# EAGLE design Blocky_Node _v1.1 (EAGLE 9.2.2)

## Sheet 1 of 2
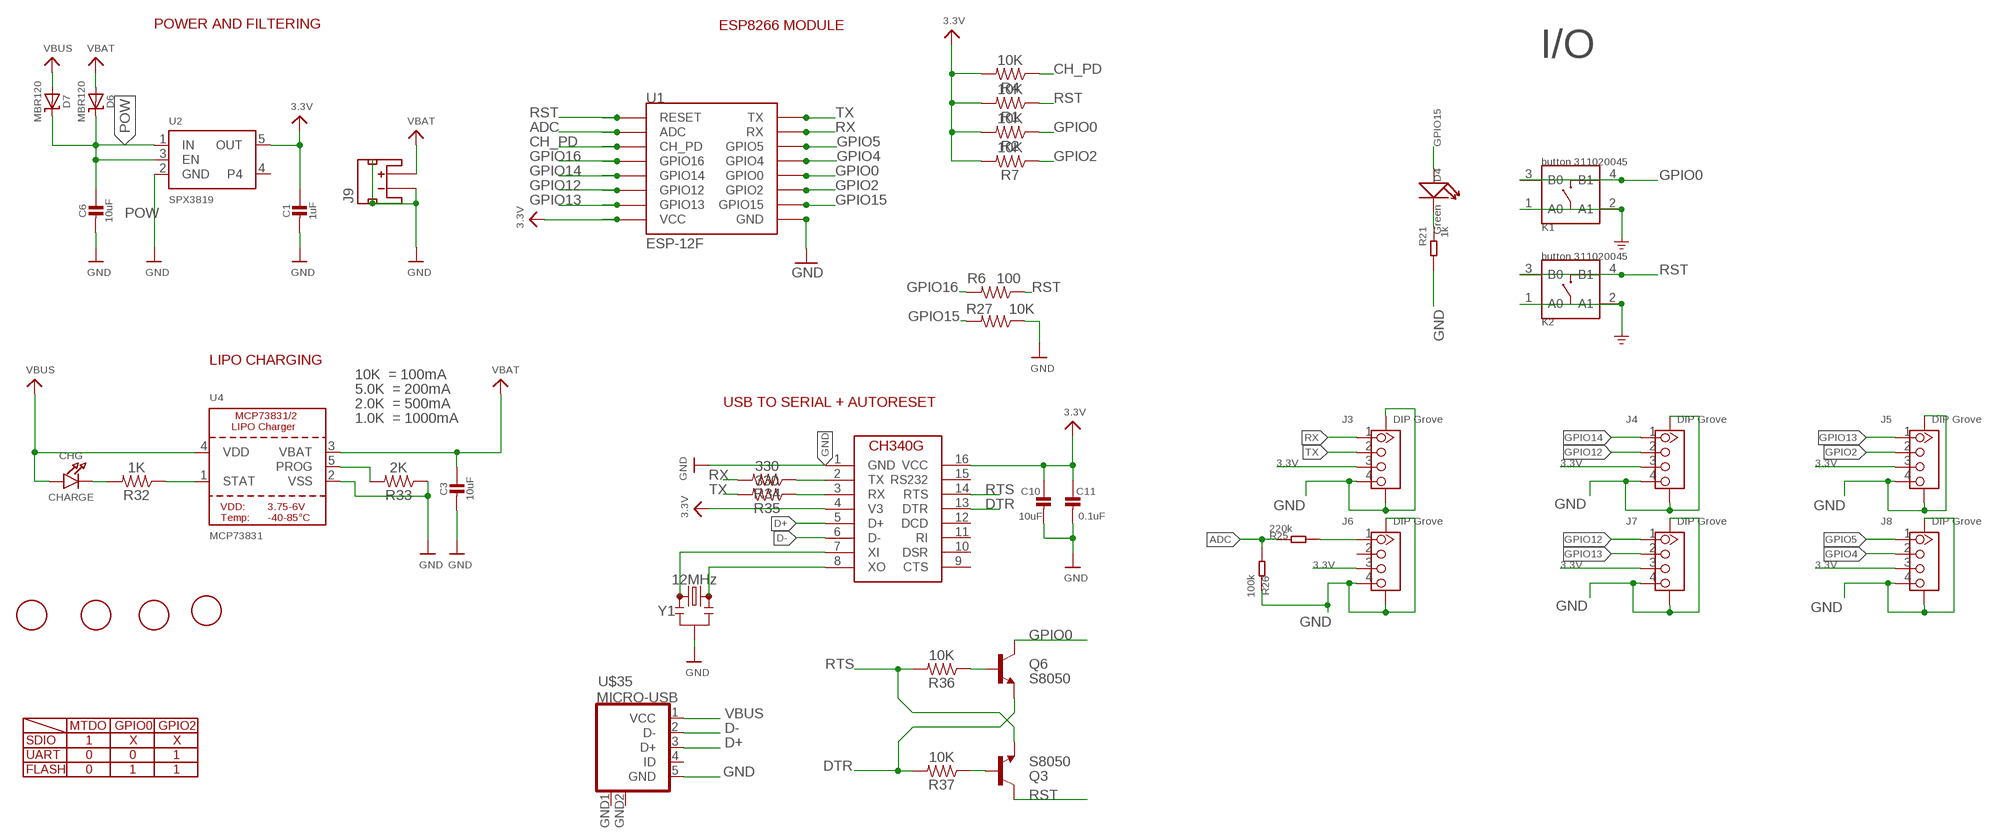
[diagram p0: schematic, sheet 1]

### Parts
C1  1uF  CAP_CERAMIC_0603  [_0603]
C3  10uF  CAP_CERAMIC_0603  [_0603]
C6  10uF  CAP_CERAMIC_0603  [_0603]
C10  10uF  CAP_CERAMIC_0603  [_0603]
C11  0.1uF  CAP_CERAMIC_0603  [_0603]
CHG  CHARGE  LED0603  [CHIPLED_0603]
D4  Green  LED'0603'  [LED-0603]
D6  MBR120  DIODE-SCHOTTKYSOD-123  [SOD-123]
D7  MBR120  DIODE-SCHOTTKYSOD-123  [SOD-123]
J3  DIP Grove  GROVE-CONNECTOR-SMD'90D'  [HW4-SMD-2.0-90D]
J4  DIP Grove  GROVE-CONNECTOR-SMD'90D'  [HW4-SMD-2.0-90D]
J5  DIP Grove  GROVE-CONNECTOR-SMD'90D'  [HW4-SMD-2.0-90D]
J6  DIP Grove  GROVE-CONNECTOR-SMD'90D'  [HW4-SMD-2.0-90D]
J7  DIP Grove  GROVE-CONNECTOR-SMD'90D'  [HW4-SMD-2.0-90D]
J8  DIP Grove  GROVE-CONNECTOR-SMD'90D'  [HW4-SMD-2.0-90D]
J9  JST_2MM_MALE  [JST-2-SMD]
K1  button 311020045  BUTTON-4P-4.5X3.2  [SW4P-SMD-4.5X3.2X2.5MM]
K2  button 311020045  BUTTON-4P-4.5X3.2  [SW4P-SMD-4.5X3.2X2.5MM]
Q3  S8050  TRANSISTOR_NPNSOT23-3  [SOT23-3]
Q6  S8050  TRANSISTOR_NPNSOT23-3  [SOT23-3]
R1  10K  0.27OHM-0603-1/10W-1%  [0603]
R2  10K  0.27OHM-0603-1/10W-1%  [0603]
R4  10K  0.27OHM-0603-1/10W-1%  [0603]
R6  100  0.27OHM-0603-1/10W-1%  [0603]
R7  10K  0.27OHM-0603-1/10W-1%  [0603]
R21  1k  RES-0603  [R0603]
R25  220k  RES-0603  [R0603]
R26  100k  RES-0603  [R0603]
R27  10K  0.27OHM-0603-1/10W-1%  [0603]
R32  1K  0.27OHM-0603-1/10W-1%  [0603]
R33  2K  0.27OHM-0603-1/10W-1%  [0603]
R34  330  0.27OHM-0603-1/10W-1%  [0603]
R35  330  0.27OHM-0603-1/10W-1%  [0603]
R36  10K  0.27OHM-0603-1/10W-1%  [0603]
R37  10K  0.27OHM-0603-1/10W-1%  [0603]
U1  ESP-12F  ESP12SMD  [ESP12-SMD]
U2  SPX3819  VREG_SOT23-5  [SOT23-5]
U4  MCP73831  MCP73831/2  [SOT23-5@1]
U$9  FIDUCIAL  [FIDUCIAL_1MM]
U$10  FIDUCIAL  [FIDUCIAL_1MM]
U$11  FIDUCIAL  [FIDUCIAL_1MM]
U$12  FIDUCIAL  [FIDUCIAL_1MM]
U$35  MICRO-USB  [MICRO-USB]
U$44  CH340G  [SOIC16]
Y1  12MHz  RESONATOR-16MHZSMD_3.2X1.3  [RESONATOR-SMD-3.2X1.3]

### Nets
3.3V [power]: C1.1 C10.1 C11.1 J3.3 J4.3 J5.3 J6.3 J7.3 J8.3 R1.2 R2.2 R4.2 R7.2 U1.VCC U2.5(OUT) U$44.4(V3) U$44.16(VCC)
ADC: R25.1 R26.2 U1.ADC
CH_PD: R4.1 U1.CH_PD
D+: U$35.3(D+) U$44.5(D+)
D-: U$35.2(D-) U$44.6(D-)
DTR: Q6.2(E) R37.2 U$44.13(DTR)
GND [power]: C1.2 C3.2 C6.2 C10.2 C11.2 J3.4 J3.SS1 J3.SS2 J4.4 J4.SS1 J4.SS2 J5.4 J5.SS1 J5.SS2 J6.4 J6.SS1 J6.SS2 J7.4 J7.SS1 J7.SS2 J8.4 J8.SS1 J8.SS2 J9.1(-) J9.NC1(PAD1) J9.NC2(PAD2) K1.1(A0) K1.2(A1) K2.1(A0) K2.2(A1) R21.2 R26.1 R27.1 R33.1 U1.GND U2.2(GND) U4.2(VSS) U$35.5(GND) U$44.1(GND) Y1.2
GPIO0: K1.3(B0) K1.4(B1) Q6.3(C) R2.1 U1.GPIO0
GPIO2: J5.2 R7.1 U1.GPIO2
GPIO4: J8.2 U1.GPIO4
GPIO5: J8.1 U1.GPIO5
GPIO12: J4.2 J7.1 U1.GPIO12
GPIO13: J5.1 J7.2 U1.GPIO13
GPIO14: J4.1 U1.GPIO14
GPIO15: D4.+ R27.2 U1.GPIO15
GPIO16: R6.2 U1.GPIO16
N$1: CHG.C R32.2
N$2: Q3.1(B) R37.1
N$5: Q6.1(B) R36.1
N$6: U$44.7(XI) Y1.1
N$9: J6.1 R25.2
N$10: U$44.8(XO) Y1.3
N$14: D4.- R21.1
N$21: R34.1 U$44.2(TX)
N$27: R35.1 U$44.3(RX)
POW [power]: C6.1 D6.C D7.C U2.1(IN) U2.3(EN)
PROG: R33.2 U4.5(PROG)
RST: K2.3(B0) K2.4(B1) Q3.3(C) R1.1 R6.1 U1.RESET
RTS: Q3.2(E) R36.2 U$44.14(RTS)
RX: J3.1 R34.2 U1.RXD0(RX)
STAT: R32.1 U4.1(STAT)
TX: J3.2 R35.2 U1.TXD0(TX)
VBAT [power]: C3.1 D6.A J9.2(+) U4.3(VBAT)
VBUS [power]: CHG.A D7.A U4.4(VDD) U$35.1(VCC)
Unconnected: J6.2 U2.4 U$35.4(ID) U$44.9(CTS) U$44.10(DSR) U$44.11(RI) U$44.12(DCD) U$44.15(RS232)

### Notes on the sheet
- POWER AND FILTERING | ESP8266 MODULE
- I/O
- LIPO CHARGING
- 10K  = 100mA
- 5.0K  = 200mA
- 2.0K  = 500mA | USB TO SERIAL + AUTORESET
- 1.0K  = 1000mA
- MTDO | GPIO0 | GPIO2
- SDIO | 1 | X | X
- UART | 0 | 0 | 1
- FLASH | 0 | 1 | 1

## Sheet 2 of 2

## Power pins joined to a net without a drawn wire
GND: U$35.GND1(GND) U$35.GND2(GND)

## Library data of the parts
C1 C3 C6 C10 C11 = microbuilder:CAP_CERAMIC: Ceramic Capacitors 0402 - 0402 Surface Mount Capacitors 16pF 50V 5% [Digikey: 445-4899-2-ND] 18pF 50V 5% [Digikey: 490-1281-2-ND] 22pF 50V 5% [Digikey: 490-1283-2-ND] 68pF 50V 5% [Digikey: 490-1289-2-ND] 0.1uF 10V 10% [Digikey: 490-1318-2-ND] 1.0uF 6.3V 10% [Digikey: 490-1320-2-ND] 0603 - 0603 Surface Mount Capacitors 16 pF 50V 5% [Digikey: 445-5051-2-ND] 22 pF 50V [Digikey: PCC220ACVTR-ND] 33 pF 50V 5% [Digikey: 490-1415-1-ND] 56pF 50V 5% [Digikey: 490-1421-1-ND] 220pF 50V 5% [Digikey: 445-1285-1-ND] 680 pF 50V 2200 pF 50V 5% C0G [Digikey: 445-1297-1-ND] 5600 pF 100V 5% X7R [Digikey: 478-3711-1-ND] 0.1 µF 25V 10% [Digikey: PCC2277TR-ND] 0.22 µF 16V 10% X7R [Digikey: 445-1318-1-ND] 1.0 µF 25V 10% [Digikey: 445-5146-2-ND] 0603 - RF Specific 3pF 250V +/-0.1pF RF [Digikey: 712-1347-1-ND] 18 pF 250V 5% [Digikey: 478-3505-1-ND or 712-1322-1-ND] 56 pF 250V 5% C0G RF [Digikey: 490-4867-1-ND] 68 pF 250V RF [Digikey: 490-4868-1-ND] 0805 - 0805 Surface Mount Capacitors 220 pF 250V 2% RF Ceramic Capacitor [Digikey: 712-1398-1-ND] 1000 pF 50V 2% NP0 Ceramic Capacitor [Digikey: 478-3760-1-ND] 0.1 µF 25V 10% Ceramic Capacitor [Digikey: PCC1828TR-ND] 1.0 µF 16V 10% Ceramic Capacitor[Digikey: 490-1691-2-ND] 10.0 µF 10V 10% Ceramic Capacitor[Digikey: 709-1228-1-ND] 10.0 uF 16V 10% Ceramic Capacitor [Digikey: 478-5165-2-ND] 47 uF 6.3V 20% Ceramic Capacitor [Digikey: 587-1779-1-ND or 399-5506-1-ND] 1206 - 1206 Surface Mount Capacitors 47uF 10V 20% Ceramic Capacitor [Digikey: 490-5528-1-ND or 399-5508-1-ND or 445-6010-1-ND] 100uF 6.3V -20%, +80% Y5V Ceramic Capacitor (Digikey: 490-4512-1-ND, Mouser: 81-GRM31CF50J107ZE1L)
CHG = microbuilder:LED: LED 0603 - 0603 Surface Mount Package 2mA: Green LED - Low Power (3.9mcd, 2ma, 1.7Vf) - Digikey: 475-2709-2-ND Orange LED - Low Power (9.8mcd, 2ma, 1.8Vf) - Digikey: 475-1194-2-ND Red LED - Low Power (5mcd, 2ma, 1.8Vf) - Digikey: 475-1195-2-ND Yellow LED - Low Power (7mcd, 2ma, 1.8Vf) - Digikey: 475-1196-2-ND 5mA: Blue LED - Low Power (17mcd, 5ma, 2.9Vf) - Digikey: LNJ937W8CRACT-ND 0805 - 0805 Surface Mount Package 2mA: Red LED (8.8mcd, 2mA, 1.8Vf, Clear) - Low Power [Digikey: 475-2510-1-ND] Green LED (5mcd, 2mA, 1.8Vf, Clear) - Low Power [Digikey: 475-2730-1-ND] Yellow LED (11.3mcd, 2mA, 1.8Vf, Clear) - Low Power [Digikey: 475-2555-1-ND] 20mA: Red LED (104mcd, 20mA, Diffused) - LS R976 [Digikey: 475-1278-6-ND] Red LED (12mcd, 20mA, 2.0Vf, Clear) - APT2012EC [Digikey: 754-1128-1-ND] Green LED (15mcd, 20mA, 2.2Vf, Clear) - APT2012GC [Digikey: 754-1131-1-ND] Orange LED (160mcd, 20mA, 2.1Vf, Clear) - APT2012SECK [Digikey: 754-1130-1-ND] 1206 - 1206 Surface Mount Package Green LED (26mcd, 20mA, Diffused) - LG N971 [Digikey: 475-1407-6-ND] Red LED (15mcd, 20mA, Diffused) - LH N974 [Digikey: 475-1416-6-ND]
D4 = Discrete-new:LED
D6 D7 = microbuilder:DIODE-SCHOTTKY
J3-J8 = Connector-new:GROVE-CONNECTOR-SMD: 4P-SMD-2.0:320110030;4P-SMD-2.0-90D:320110032
J9 = SparkFun-Connectors:JST_2MM_MALE: Mates to single-cell LiPo batteries. CONN-08352; PROD_ID: CONN-08352
K1 K2 = Discrete-new:BUTTON-4P: SW4-6.0X6.0X5.0MM:311020024;SW4-8.0X8.0X9.0MM:311020028;SW4-SMD-6.0X6.0X5.0MM:311020004;SW4-SMD-3.35X3.35X1.5MM:311020030;SW4-SMD-5.2X5.2X2.5MM:311020046
Q3 Q6 = SparkFun:TRANSISTOR_NPN: Transistor NPN BJT configuration in SOT23 package. MMBT2222 is the common NPN we use. Double check BCE configuration again layout.
R1 R2 R4 R6 R7 R27 R32-R37 = SparkFun-Resistors:0.27OHM: 0.27Ω resistor A resistor is a passive two-terminal electrical component that implements electrical resistance as a circuit element. Resistors act to reduce current flow, and, at the same time, act to lower voltage levels within circuits. - Wikipedia; PROD_ID: RES-08787; VALUE: 0.27
R21 R25 R26 = Discrete-new:RES
U1 = esp8266modules:ESP12: ESP8266 Wifi module 12
U2 = microbuilder:VREG_SOT23-5: SOT23-5 Fixed Voltage Regulators To better organise some of the SOT23-5 fixed voltage regulators in this library, this new part was created. Part Current Out V Out V In V Dropout Digikey Part No. ADP121 150mA 3.3V 3.4-5.5V 0.09V @ 150mA ADP121-AUJZ33R7CT-ND ADP121 150mA 3.0V 3.1-5.5V 0.09V @ 150mA ADP121-AUJZ30R7CT-ND ADP122 300mA 3.3V 3.4-5.5V 0.085V @ 300mA ADP122AUJZ-3.3-R7CT-ND ADP1712 300mA 3.3V 3.5-5.5V 0.17V @ 300mA ADP1712AUJZ-3.3-R7TR-ND AP7311 (Low Cost) 150mA 3.3V 3.5-6V 0.15V @ 150mA AP7311-33WG-7DICT-ND LD39015M18R 150mA 1.8V 1.9V-5.5V 0.08V @ 100mA 497-6977-1-ND MCP1824T-3302E/OT 300mA 3.3V 3.5V-6V 0.2V @ 300mA MCP1824T-3302E/OTCT-ND MIC5205-2.5YM5 TR 150mA 2.5V 2.7-16V 0.165V @ 150mA 576-1257-2-ND MIC5205-3.0YM5 TR 150mA 3.0V 3.2V-16V 0.165V @ 150mA 576-1258-2-ND MIC5205-3.3YM5 TR 150mA 3.3V 3.5V-16V 0.165V @ 150mA 576-1259-2-ND TPS780330220 150mA 3.3V+2.2V 3.6-5.5V 250mV Max 296-23332-1-ND TDA3663/N1,135 100mA 3.3V 3.5-45V 0.18V @ 50mA 568-5343-1-ND
U4 = microbuilder:MCP73831/2: MCP73831/2 LIPO Charger VDD: 3.75 - 6V Temp -40 - 85°C Programmable Charge Rate: 15-500mA NOTE: STAT is a tri-state logic output on the MCP73831 and an open-drain output on the MCP73832. SOT23-5 with 4.2V output and tri-state logic on STAT = MCP73831T-2ACI/OT
U$9-U$12 = adafruit:FIDUCIAL: For use by pick and place machines to calibrate the vision/machine, 1mm By microbuilder.eu
U$35 = My-Eagle-Lib:MICRO-USB: Micro USB B connector
U$44 = My-Eagle-Lib:CH340G
Y1 = SparkFun-Clocks:RESONATOR-16MHZ: 16MHz Resonator Digikey Example <http://www.digikey.com/product-detail/en/murata-electronics-north-america/CSTCE16M0V53-R0/490-1198-1-ND/584635> Frequency: 16MHz Frequency Stability: ±0.3% Frequency Tolerance: ±0.5% Capacitance: 15pF SparkFun Products SparkFun OpenLog <https://www.sparkfun.com/products/13712> SparkFun MicroView - OLED Arduino Module <https://www.sparkfun.com/products/12923>; PROD_ID: XTAL-08900; VALUE: 16MHz

## Net classes
1 power: width 0.381 mm

## Board
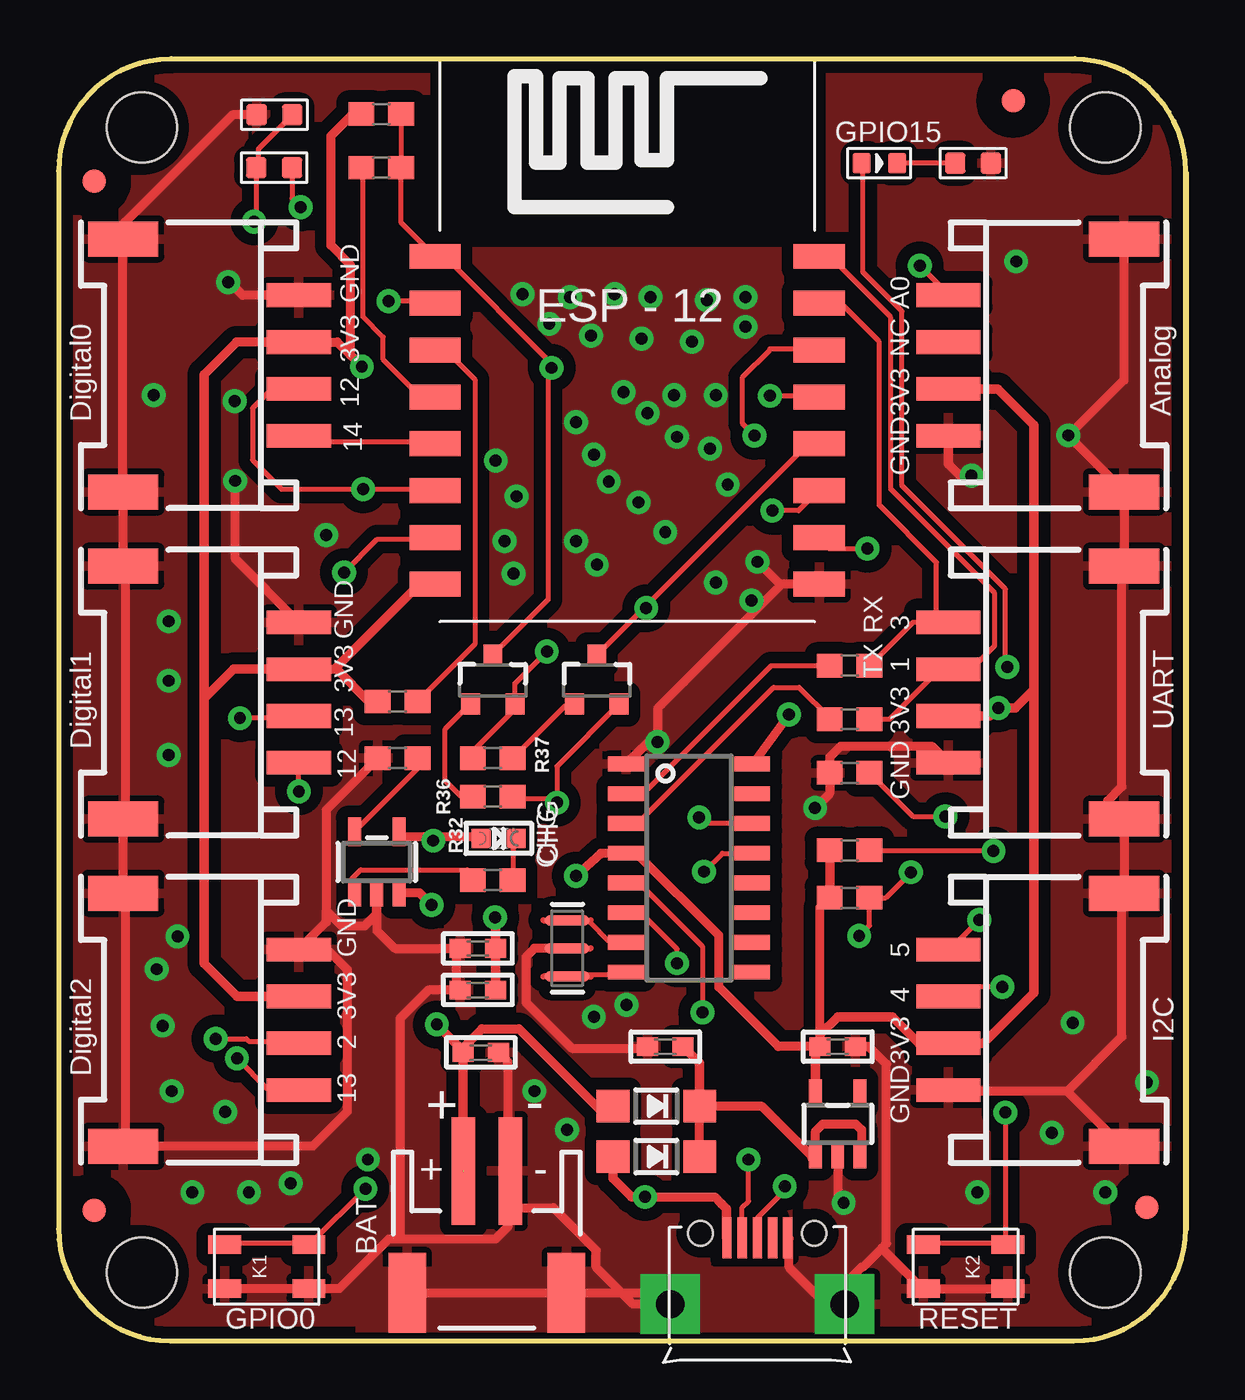
[diagram p1: board, top side]
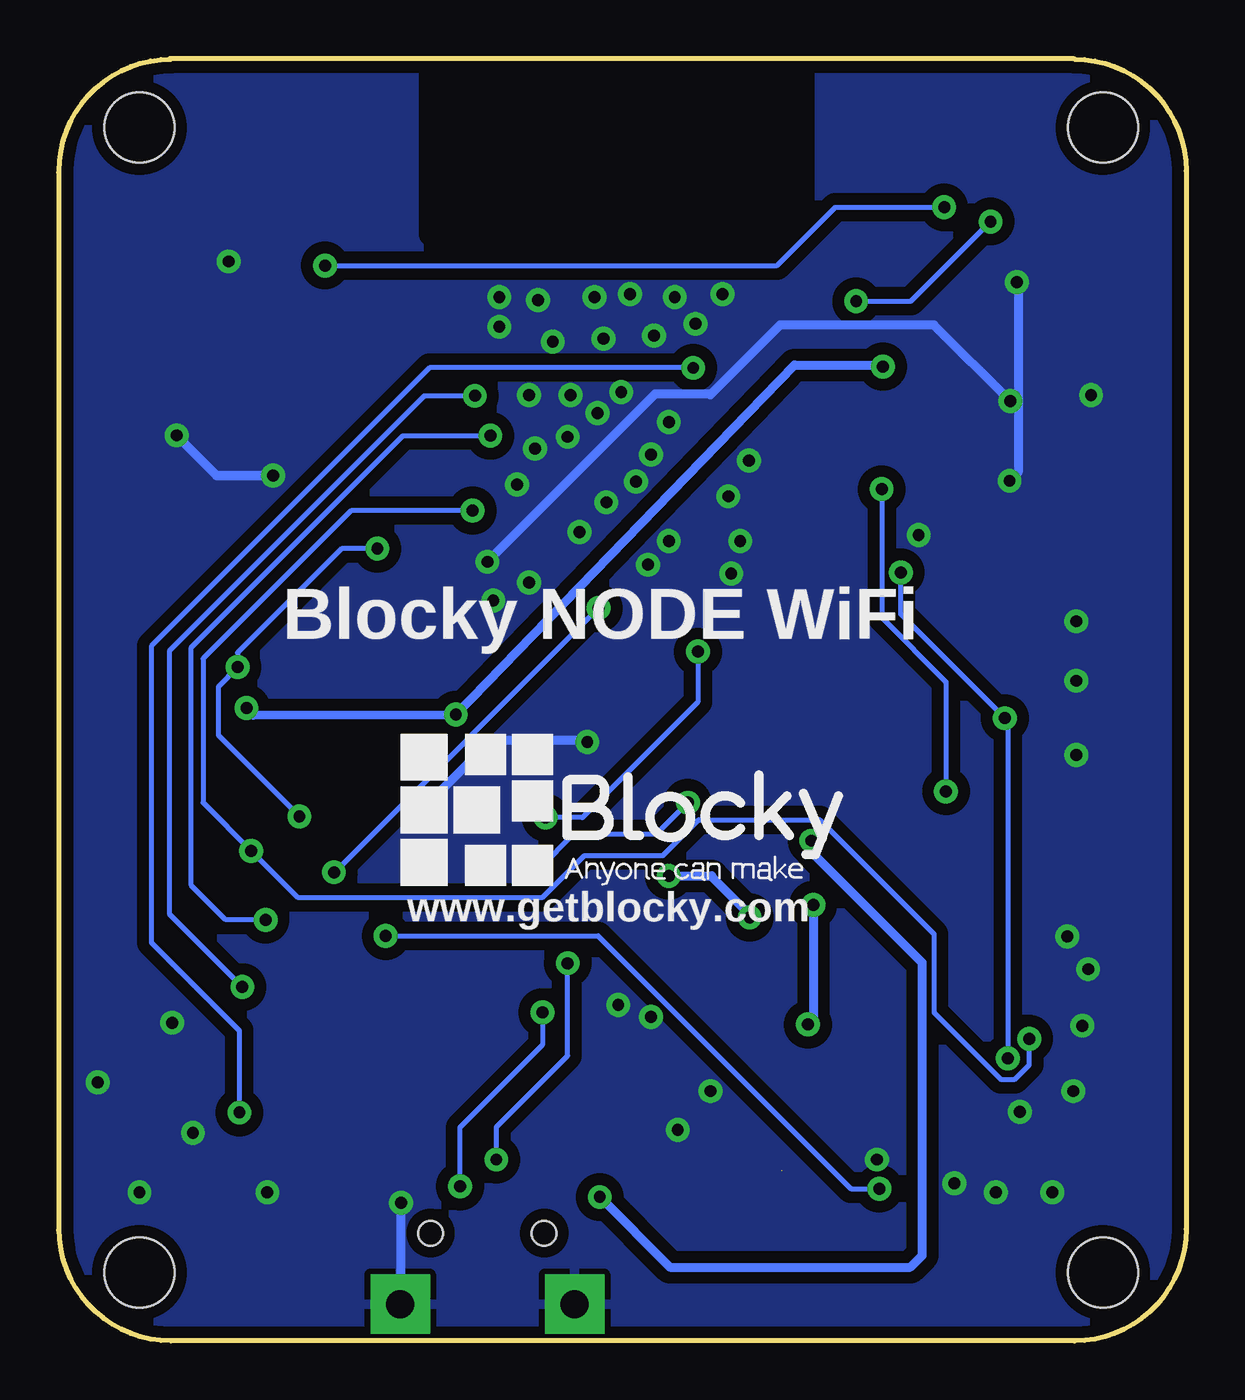
[diagram p2: board, bottom side, seen from below]

Size 48.16 x 54.76 mm. Coordinates in mm from the lower left corner, seen from the top.
Outline: 43.35,54.74 arc-90 48.13,49.96 48.13,4.78 arc-90 43.35,0 4.78,0 arc-90 0,4.78 0,49.96 arc-90 4.78,54.74
Outline: 48.16,49.91 48.16,4.73
Outline: 4.83,54.76 43.4,54.76
Copper layers (1*16): Top 0.035mm / dielectric 1.5mm / Bottom 0.035mm
Design rules "SparkFun": minimum track width 8mil, minimum drill 20mil, track to track 8mil, track to pad 8mil, pad to pad 8mil, via to via 8mil, smd to smd 8mil, copper to edge 10mil, drill to drill 8mil, minimum pad ring 12mil, minimum via ring 10mil, stop-mask expansion 4mil, vias tented up to drill 25mil, thermal gap 10mil
Holes 3 mm at 3.56,2.92 44.7,2.92 3.56,51.82 44.7,51.82
tRestrict: area 16.4,47.2 to 32.3,54.5
bRestrict: area 16.4,47.2 to 32.3,54.5

### Footprints (pad centres in the part's own frame; a part is rotated, then mirrored left to right if it is on the bottom)
_0603 = smd 0.9 x 0.8: 1 -0.762,0; 2 0.762,0
CHIPLED_0603 = smd 0.8 x 0.8: A 0,-0.75; C 0,0.75
LED-0603 = smd 0.762 x 0.889: + -0.762,0; - 0.762,0
SOD-123 = smd 1.4 x 1.4: A 1.85,0; C -1.85,0
HW4-SMD-2.0-90D = smd 1.01 x 2.74: 1 -3,-0.1; 2 -1,-0.1; 3 1,-0.1; 4 3,-0.1 | smd 1.5 x 3: SS1 -5.4,7.4; SS2 5.4,7.4
JST-2-SMD = smd 1 x 4.6: 1 -1,-3.7; 2 1,-3.7 | smd 1.6 x 3.4: NC1 -3.4,1.5; NC2 3.4,1.5
SW4P-SMD-4.5X3.2X2.5MM = smd 1.4 x 0.8: 1 -1.8,-0.94; 2 1.8,-0.94; 3 1.8,0.94; 4 -1.8,0.94
SOT23-3 = smd 0.8 x 0.9: 1 -0.95,-1; 2 0.95,-1; 3 0,1.1
0603 = smd 1.1 x 1: 1 -0.85,0; 2 0.85,0
R0603 = smd 0.889 x 0.889: 1 0,0.762; 2 0,-0.762
ESP12-SMD = smd 2.184 x 1.067: ADC -8.3,3.8; CH_PD -8.3,1.8; GND 8.1,-8.2; GPIO0 8.1,-2.2; GPIO2 8.1,-4.2; GPIO4 8.1,-0.2; GPIO5 8.1,1.8; GPIO12 -8.3,-4.2; GPIO13 -8.3,-6.2; GPIO14 -8.3,-2.2; GPIO15 8.1,-6.2; GPIO16 -8.3,-0.2; RESET -8.3,5.8; RXD0 8.1,3.8; TXD0 8.1,5.8; VCC -8.3,-8.2
SOT23-5 = smd 0.55 x 1.2: 1 -0.95,-1.3; 2 0,-1.3; 3 0.95,-1.3; 4 0.95,1.3; 5 -0.95,1.3
SOT23-5@1 = smd 0.55 x 1.2: 1 -0.95,-1.3; 2 0,-1.3; 3 0.95,-1.3; 4 0.95,1.3; 5 -0.95,1.3
FIDUCIAL_1MM = smd 1 x 1: 1 0,0
MICRO-USB = smd 0.4 x 1.75: 1 -1.3,4.525; 2 -0.65,4.525; 3 0,4.525; 4 0.65,4.525; 5 1.3,4.525 | drill 1.2 pad 2.54 square: GND1 -3.725,1.7; GND2 3.725,1.7 | hole 1.05: -2.425,4.73; 2.425,4.73
SOIC16 = smd 0.635 x 1.524: 1 -4.445,-2.695; 2 -3.175,-2.695; 3 -1.905,-2.695; 4 -0.635,-2.695; 5 0.635,-2.695; 6 1.905,-2.695; 7 3.175,-2.695; 8 4.445,-2.695; 9 4.445,2.695; 10 3.175,2.695; 11 1.905,2.695; 12 0.635,2.695; 13 -0.635,2.695; 14 -1.905,2.695; 15 -3.175,2.695; 16 -4.445,2.695
RESONATOR-SMD-3.2X1.3 = smd 0.45 x 1.905: 1 -1.2,0; 2 0,0; 3 1.2,0

### Placement (x,y rotation side)
C1  33.27,12.57 0 top
C3  18.03,12.32 0 top
C6  25.91,12.57 180 top
C10  17.91,16.76 180 top
C11  17.91,14.99 180 top
CHG  18.8,21.46 270 top
D4  35.05,50.29 0 top
D6  25.53,10.03 180 top
D7  25.53,7.87 180 top
J3  38.1,27.69 270 top
J4  10.16,41.66 90 top
J5  10.16,13.72 90 top
J6  38.1,41.66 270 top
J7  10.16,27.69 90 top
J8  38.1,13.72 270 top
J9  18.29,3.56 180 top
K1  8.89,3.17 0 top
K2  38.73,3.17 0 top
Q3  18.54,28.19 0 top
Q6  22.99,28.19 0 top
R1  13.78,52.39 180 top
R2  33.78,18.92 180 top
R4  14.48,27.3 180 top
R6  13.78,50.1 180 top
R7  33.78,20.95 180 top
R21  39.05,50.29 90 top
R25  9.21,50.1 90 top
R26  9.22,52.36 90 top
R27  33.78,24.26 0 top
R32  18.54,19.69 0 top
R33  14.48,24.89 0 top
R34  33.78,28.83 0 top
R35  33.78,26.54 0 top
R36  18.54,24.89 180 top
R37  18.54,23.24 0 top
U1  24.38,40.51 0 top
U2  33.27,9.27 0 top
U4  13.59,20.45 0 top
U$9  1.52,49.53 0 top
U$10  40.77,52.96 0 top
U$11  1.52,5.59 0 top
U$12  46.48,5.71 0 top
U$15  [BLOCKY_LOGO]  34.54,19.18 0 bottom
U$35  29.84,-0.13 0 top
U$44  26.92,20.19 270 top
Y1  21.72,16.76 270 top

### Tracks (layer width: path | path; a pad name or v marks a point on that pad's centre or on a via)
3.3V  (via drill 0.51)
  Top 0.381: v31.19,26.75 29.67,24.69 U$44.16 | v40.13,27.03 40.12,27.04 | v18.64,18.09 18.67,18.09 | v22.1,19.86 23.16,20.83 U$44.4 24.69,20.83 28.19,17.32 28.19,15.11 30.73,12.57 C1.1 32.51,18.5 R2.2 | R4.2 13.25,27.3 11.87,28.69 J7.3 11.79,28.69 15.42,32.31 15.54,32.31 16.05,32.31 U1.VCC | R1.2 12.56,52.39 11.63,51.46 11.63,46.79 12.47,45.95 12.47,42.09 | 8.78,42.66 7.6,42.66 6.22,41.27 | J4.3 11.9,42.66 12.47,42.09 | v12.95,41.6 12.47,42.09 | U2.5 32.31,10.57 32.32,10.7
  Top 0.406: 32.32,10.7 32.32,12.38 C1.1 32.51,13.08 33.27,13.84 35.6,13.84 36.73,12.72 J8.3 38.02,12.7 39.5,12.7 41.66,14.86 41.66,27.81 | R2.2 R7.2 | 18.67,18.09 C10.1 C11.1 | J5.3 7.64,14.72 6.22,16.13 6.22,27.43 | J7.3 7.48,28.69 6.22,27.43 | 6.22,41.27 6.22,27.43 | J4.3 8.78,42.66 | J6.3 40.12,40.66 41.66,39.12 41.66,27.81 | 41.66,27.81 40.87,27.03 v40.13,27.03 | 40.12,27.04 39.77,26.69 J3.3
  Bottom 0.381: v40.13,27.03 39.83,26.72 v31.19,26.75 16.73,41.67 13.02,41.67 v12.95,41.6 | v22.1,19.86 20.26,19.86 20.24,19.81 18.64,18.21 v18.64,18.09
ADC  (via drill 0.51)
  Top 0.203: U1.ADC 16.05,44.4 15.54,44.4 U1.ADC | R26.2 9.96,52.32 8.53,50.9 8.53,50.19 R25.1 8.45,47.89 v8.36,47.8 | v14.1,44.4 15.44,44.4 U1.ADC
  Bottom 0.203: v14.1,44.4 11.76,44.4 v8.36,47.8
CH_PD
  Top 0.203: 16.56,42.27 17.78,41.05 17.78,29.76 R4.1 | 16.15,42.27 16.56,42.27 | U1.CH_PD 16.51,42.31 16.56,42.27
D+  (via drill 0.51)
  Top 0.203: v27.49,14.03 27.49,16.86 24.84,19.51 24.28,19.51 U$44.5 | U$35.3 29.86,4.42 29.86,5.27 30.92,6.33 v31.01,6.6
  Bottom 0.203: v27.49,14.03 27.49,12.64 31.01,9.12 v31.01,6.6
D-  (via drill 0.51)
  Top 0.203: U$44.6 24.87,18.29 26.42,16.74 v26.42,16.13 | U$35.2 29.2,5.7 29.46,5.97 v29.46,7.75
  Bottom 0.203: v29.46,7.75 29.46,9.13 26.42,12.18 v26.42,16.13
DTR  (via drill 0.51)
  Top 0.203: R37.2 19.41,23.16 21.11,23.16 v21.29,22.99 21.29,24.54 Q6.2 | v27.56,20.04 28.35,20.83 U$44.13
  Bottom 0.203: v27.56,20.04 27.56,20.25 26.16,21.64 22.63,21.64 v21.29,22.99
GND  (via drill 0.51)
  Top 0.381: v32.31,22.76 32.93,23.38 R27.1 32.93,24.93 33.4,25.4 37.29,25.4 J3.4 | U$44.1 25.22,25.58 v25.58,25.58 25.58,27 30.89,32.31 U1.GND 30.81,32.31 v29.84,33.27 | 11.43,18.39 11.43,22.68 13.63,24.88 R33.1 | 11.43,18.39 12.12,17.7 13.06,17.7 13.59,18.24 U4.2 13.59,17.53 14.35,16.76 C10.2 16.97,16.59 16.97,15.11 C11.2 15.8,14.99 14.61,13.79 14.61,4.34 | C6.2 25.07,12.5 21.92,12.5 19.96,14.45 19.96,16.41 20.32,16.76 Y1.2 | C1.2 34.59,12.57 35.36,11.81 35.36,4.17 35.15,3.96 | 35.15,3.96 34.34,3.15 34.29,3.15 33.57,2.43 U$35.GND2 32.77,1.57 31.19,3.15 31.19,4.37 U$35.5 | 35.15,3.96 36.88,2.24 K2.1 37.08,2.24 40.44,2.24 K2.2 | K1.1 7.11,2.24 10.67,2.24 K1.2 10.87,2.24 11.99,2.24 14.1,4.34 14.61,4.34 | C3.2 19.18,11.94 19.18,7.34 19.2,7.32 J9.1 | 14.61,4.34 18.64,4.34 19.2,4.9 19.2,7.11 J9.1 | J9.1 19.3,5.69 21.13,5.69 22.96,3.86 22.96,3.15 24.54,1.57 U$35.GND1 25.64,2.06 J9.NC1 J9.NC2 | 8.53,52.45 R26.1 7.44,52.36 7.42,52.35 2.85,47.78 2.85,47.14 J4.SS2 2.74,46.94 2.74,36.37 J4.SS1 2.74,36.17 2.74,33.12 J7.SS2 2.85,32.92 2.85,22.45 J7.SS1 2.74,22.25 2.74,19.2 J5.SS2 2.85,19 2.85,8.43 J5.SS1 2.85,8.33 10.87,8.33 12.34,9.8 12.34,15.85 11.53,16.66 10.26,16.66 J5.4 11.43,17.89 11.43,18.39 | J7.4 9.65,30.69 | 10.26,44.6 J4.4 7.87,44.66 7.32,45.21 v7.24,45.21 | 38,38.71 J6.4 | 43.08,10.67 38.1,10.67 J8.4 | 43.08,10.67 45.41,8.33 J8.SS2 | 43.08,10.67 45.41,13.01 45.41,19 J8.SS1 45.52,19.2 45.52,22.25 J3.SS2 45.41,22.45 44.81,23.06 45.41,23.67 45.41,32.92 J3.SS1 45.52,33.12 45.52,36.17 J6.SS2 45.41,36.37 v43.12,38.67 43.08,38.63 43.08,38.61 45.5,41.03 J6.SS1
  Top 0.381: 10.36,30.58 J7.4 | U2.2 33.27,6.15 v33.53,5.89 | J7.4 7.54,33.4 v7.54,36.73
  Top 0.406: J6.4 38,37.44 38.61,36.83 38.86,36.83 v38.99,36.96
  Bottom 0.381: v32.31,22.76 32.31,23.01 29.67,25.65 25.65,25.65 v25.58,25.58 25.48,25.68 | v33.53,5.89 33.53,1.63 U$35.GND2 | 7.18,40.26 7.18,45.21 v7.24,45.21 | 7.18,40.26 7.18,37.1 v7.54,36.73 | 20.3,40.44 17.35,43.38 10.77,43.38 v7.52,40.13 7.3,40.13 7.18,40.26 | 20.3,40.44 20.32,40.41 | 20.3,40.44 22.68,40.44 v29.84,33.27
  Bottom 0.406: v38.99,36.96 41.4,36.96 v43.12,38.67
  other vias: 4.7,30.73 4.7,28.19 4.7,25.02 5.08,17.27 4.19,15.88 4.45,13.46 4.83,10.67 7.11,9.78 5.71,6.35 8.13,6.35 9.91,6.73 13.21,7.75 39.24,6.35 42.42,8.89 46.48,11.05 43.31,13.59 40.89,46.1 11.43,34.42 19.43,32.77 4.06,40.39 44.7,6.35 21.72,9.02 20.32,10.67 22.86,13.84 24.26,14.35 29.34,43.31 28.07,40.39 19.56,36.07 21.84,44.58 27.69,44.45 22.1,39.24 24.13,40.51 25.15,39.62 26.42,38.61 27.81,38.1 22.86,37.85 23.5,36.7 26.29,40.39 28.57,36.58 24.77,35.81 25.91,34.54 19.05,34.16 22.1,34.16 18.67,37.59 22.99,33.15 28.07,32.38 29.59,31.62 20.95,43.43 22.73,42.93 24.89,42.8 27.05,42.67 23.75,44.7 25.27,44.58 29.34,44.58 19.81,44.7
  pour Top (isolate 0.254, no thermals): 12.7,3.17 34.29,3.17 34.29,0.38 12.7,0.38
  pour Top (isolate 0.508): 0.13,54.74 48.26,54.74 48.26,0 0.13,0
  pour Bottom (isolate 0.508): 0,54.74 48.26,54.74 48.26,0 0,0
GPIO0  (via drill 0.51)
  Top 0.203: K1.4 7.11,4.17 10.67,4.17 K1.3 10.77,4.17 v13.11,6.5 | 32.11,38.3 32.41,38.3 U1.GPIO0 32.11,38.3 | 25.04,31.34 32,38.3 32.11,38.3 | 25.04,31.34 23.06,29.36 Q6.3 | v36.4,20.02 36.4,19.99 35.33,18.92 R2.1 34.63,17.74 v34.19,17.3 | v25.09,31.29 25.04,31.34
  Bottom 0.203: v36.4,20.02 36.37,20.02 v25.09,31.29 | v13.11,6.5 14.33,6.5 25.12,17.3 v34.19,17.3
GPIO2  (via drill 0.51)
  Top 0.203: v30.48,35.46 31.6,35.46 32.41,36.27 U1.GPIO2 | v39.93,20.93 34.65,20.93 R7.1 | v6.71,12.9 8.03,12.9 8.13,12.8 10.16,12.8 J5.2
  Bottom 0.203: v30.48,35.46 35.66,35.46 41.99,29.13 41.99,22.99 v39.93,20.93 37.95,18.95 27.48,18.95 25.7,20.73 22.35,20.73 20.83,22.25 15.65,22.25 10.77,17.37 10.77,14.02 7.92,11.18 7.32,11.18 6.71,11.79 v6.71,12.9
GPIO4  (via drill 0.51)
  Top 0.203: v40.31,15.11 38.48,15.11 38.1,14.73 J8.2 | v30.38,40.36 32.44,40.36 32.51,40.34 U1.GPIO4
  Bottom 0.203: v30.38,40.36 32.54,40.36 43.41,29.49 43.41,18.21 v40.31,15.11
GPIO5  (via drill 0.51)
  Top 0.203: v39.32,17.98 38.1,16.76 J8.1 | v29.72,38.66 29.21,39.17 29.21,41.15 30.38,42.31 30.38,42.37 32.41,42.37 U1.GPIO5
  Bottom 0.203: v29.72,38.66 33.45,38.66 42.49,29.62 42.49,19.46 41.02,17.98 v39.32,17.98
GPIO12  (via drill 0.51)
  Top 0.203: J4.2 10.16,40.64 9.09,40.64 8.28,39.83 8.28,37.62 9.53,36.37 v13.01,36.37 16.05,36.37 U1.GPIO12 | v10.26,23.47 10.26,24.59 J7.1
  Bottom 0.203: v10.26,23.47 10.26,28.14 13.01,30.89 v13.01,36.37
GPIO13  (via drill 0.51)
  Top 0.203: v12.19,32.82 13.61,34.24 16.05,34.24 U1.GPIO13 | J7.2 10.17,26.59 v7.75,26.59 | v7.62,12.06 8.91,10.77 10.16,10.77 J5.1
  Bottom 0.203: v12.19,32.82 12.19,31.04 v7.75,26.59 7.62,26.47 v7.62,12.06
GPIO14
  Top 0.203: J4.1 10.26,38.61 10.46,38.41 16.05,38.41 U1.GPIO14
GPIO15  (via drill 0.51)
  Top 0.203: v34.54,33.83 32.92,33.83 32.51,34.24 U1.GPIO15 | R27.2 36.49,22.4 v37.87,22.4 | v40.51,28.78 40.44,28.85 40.44,32.11 36.02,36.52 36.02,43.97 34.34,45.64 34.34,50.29 D4.+
  Bottom 0.203: v34.54,33.83 36.07,33.83 40.51,29.39 v40.51,28.78 40.89,28.4 40.89,28.37 41.33,27.94 41.33,25.86 v37.87,22.4
GPIO16
  Top 0.203: R6.2 13.01,50.09 13.01,43.74 13.87,42.88 13.87,41.91 15.46,40.31 U1.GPIO16 16.05,40.34 16,40.28
N$1
  Top 0.203: R32.2 19.41,19.71 19.41,21.03 19.81,21.44 CHG.C
N$2
  Top 0.203: Q3.1 17.57,27.19 16.51,26.14 16.51,23.93 17.2,23.24 R37.1
N$5
  Top 0.203: Q6.1 21.97,27.13 21.64,27.13 19.41,24.89 R36.1
N$6
  Top 0.203: 22.58,17.98 22.6,17.96 | 22.67,17.89 23.5,17.07 24.18,17.07 U$44.7 | 22.66,17.88 22.67,17.89 | Y1.1 22.6,17.96 | 22.6,17.96 22.67,17.89
N$9  (via drill 0.51)
  Top 0.203: v10.34,48.41 9.97,48.78 R25.2 | v36.78,45.92 38,44.7 J6.1
  Bottom 0.203: v10.34,48.41 14.99,48.41 17.48,45.92 v36.78,45.92
N$10
  Top 0.203: U$44.8 24.1,15.62 21.89,15.62 | 21.89,15.62 21.83,15.56 21.74,15.54 21.74,15.56 | 21.89,15.62 21.95,15.65 Y1.3
N$14
  Top 0.203: R21.1 D4.-
N$21
  Top 0.203: U$44.2 24.97,23.37 30.43,28.83 R34.1
N$27
  Top 0.203: R35.1 32.92,26.62 31.62,27.91 30.53,27.91 24.77,22.15 24.28,22.15 U$44.3
POW
  Top 0.381: D7.C D6.C 30.01,10.03 32.17,7.87 | U2.1 32.32,8.96 32.64,9.27 34.04,9.27 34.29,9.02 34.29,8.04 34.24,8.03 U2.3
  Top 0.406: C6.1 27.38,11.87 D6.C | U2.1 32.17,7.81 32.17,7.87
PROG
  Top 0.203: R33.2 15.33,24.44 U4.5
RST  (via drill 0.51)
  Top 0.203: K2.4 36.98,4.17 40.44,4.17 K2.3 40.44,4.27 v40.44,9.75 | 20.9,41.71 20.9,31.66 Q3.3 | 20.9,41.71 20.9,41.81 20.9,41.88 16.56,46.23 16.15,46.23 U1.RESET 16.05,46.33 14.63,47.75 14.63,50.09 R6.1 14.63,50.19 14.63,52.32 R1.1 | 20.9,41.71 v21.06,41.55
  Bottom 0.203: v40.44,9.75 40.44,13.26 44.2,17.02 44.2,29.67 32.31,41.55 v21.06,41.55
RTS  (via drill 0.51)
  Top 0.203: R36.2 17.69,25.19 19.41,26.9 19.41,27.13 Q3.2 19.49,28.08 v20.85,29.44 | v27.36,22.35 27.61,22.1 U$44.14
  Bottom 0.203: v27.36,22.35 v27.35,22.35 25.79,22.35 20.85,27.28 v20.85,29.44
RX
  Top 0.203: R34.2 36.49,30.69 J3.1 37.49,30.68 37.49,33.25 35.05,35.69 35.05,42.67 33.43,44.3 32.51,44.3 U1.RXD0
STAT
  Top 0.203: R32.1 17.46,20.12 12.9,20.12 12.53,19.74 U4.1
TX
  Top 0.203: R35.2 35.48,26.54 37.59,28.65 38,28.65 J3.2 38.1,28.75 39.04,28.75 39.98,29.69 39.98,31.93 35.53,36.37 35.53,43.71 33.02,46.23 32.51,46.23 U1.TXD0
VBAT  (via drill 0.51)  (1 unrouted)
  Top 0.381: U4.3 15.4,19.15 v15.93,18.62 | v16.15,13.51 17.17,12.5 C3.1 17.27,12.52 18.09,13.34 19.66,13.34 23.29,9.7 D6.A
  Top 0.406: C3.1 17.27,7.27
  Bottom 0.381: v15.93,18.62 15.93,13.74 v16.15,13.51
VBUS  (via drill 0.51)
  Top 0.381: 16,21.54 14.56,21.54 U4.4 | 16,21.54 17.68,21.54 CHG.A | v16,21.36 16,21.54 | 28.31,5.86 28.03,6.15 v25.04,6.15
  Top 0.406: U$35.1 28.53,4.41 28.53,5.64 28.31,5.86 | v25.04,6.15 24.47,6.15 23.68,6.94 D7.A
  Bottom 0.381: v16,21.36 16,20.88 11.28,16.15 11.28,3.66 11.79,3.15 22.05,3.15 v25.04,6.15

### Text on the board
tPlace: GPIO15 | GND | A0 | 3V3 | NC | 12 | Digital0 | 3V3 | Analog | 14 | GND | GND | 3 | 1 | 3V3 | 13 | 3V3 | UART | Digital1 | 12 | GND | CHG | GND | 5 | 3V3 | 4 | I2C | 2 | 3V3 | Digital2 | 13 | + | - | GND | BAT | GPIO0 | RESET
bPlace: Blocky NODE WiFi
tNames: RX | TX